# Altium schematic sheet CATS-EUROC-Storage.SchDoc: CATS EuRoC Edition
size A4; DocumentNumber: Overview; Revision: V1.0; SheetNumber: 8; SheetTotal: 16; Author: Luca Jost; Subtitle: Storage
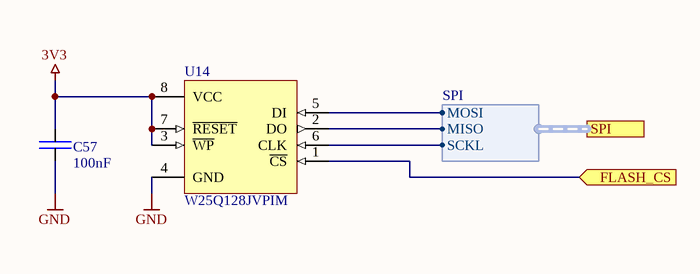
[diagram p0: CATS-EUROC-Storage.SchDoc]

## Parts
C57  100nF  [SMD Keramikkondensator 0402]
U14  W25Q128JVPIM  [SMD IC WSON-8 (6x5)]

## Ports
FLASH_CS (in), SPI (harness SPI)

## Harnesses
SPI: SCKL, MOSI, MISO

## Nets
3V3: C57.2 U14.3(~{WP}) U14.7(~{RESET}) U14.8(VCC)
GND: C57.1 U14.4(GND)
FLASH_CS: U14.1(~{CS}) ; port FLASH_CS
NetU14_2: U14.2(DO) ; port SPI.MISO
NetU14_5: U14.5(DI) ; port SPI.MOSI
NetU14_6: U14.6(CLK) ; port SPI.SCKL

## Notes on the sheet
- Title
- Author:
- Subtitle
- Date:
- Rev:
- File:
- Sheet
- of

## Library data of the parts
C57 = E6 - 100nF: SMD Ceramic Capacitor E6; Unit Price: 0.01; Number: -; Supplier: -; JLC: C307331
U14 = W25Q128JVPIM: 3V 128M-BIT / SERIAL FLASH MEMORY WITH / DUAL/QUAD SPI & QPI & DTR; ComponentLink1Description: Datasheet; ComponentLink1URL: https://www.winbond.com/resource-files/w25q128jv_dtr%20revc%2003272018%20plus.pdf; Digikey: W25Q128JVPIM-ND; JLC: C190862